# EAGLE design Shematic (EAGLE 9.0.0)
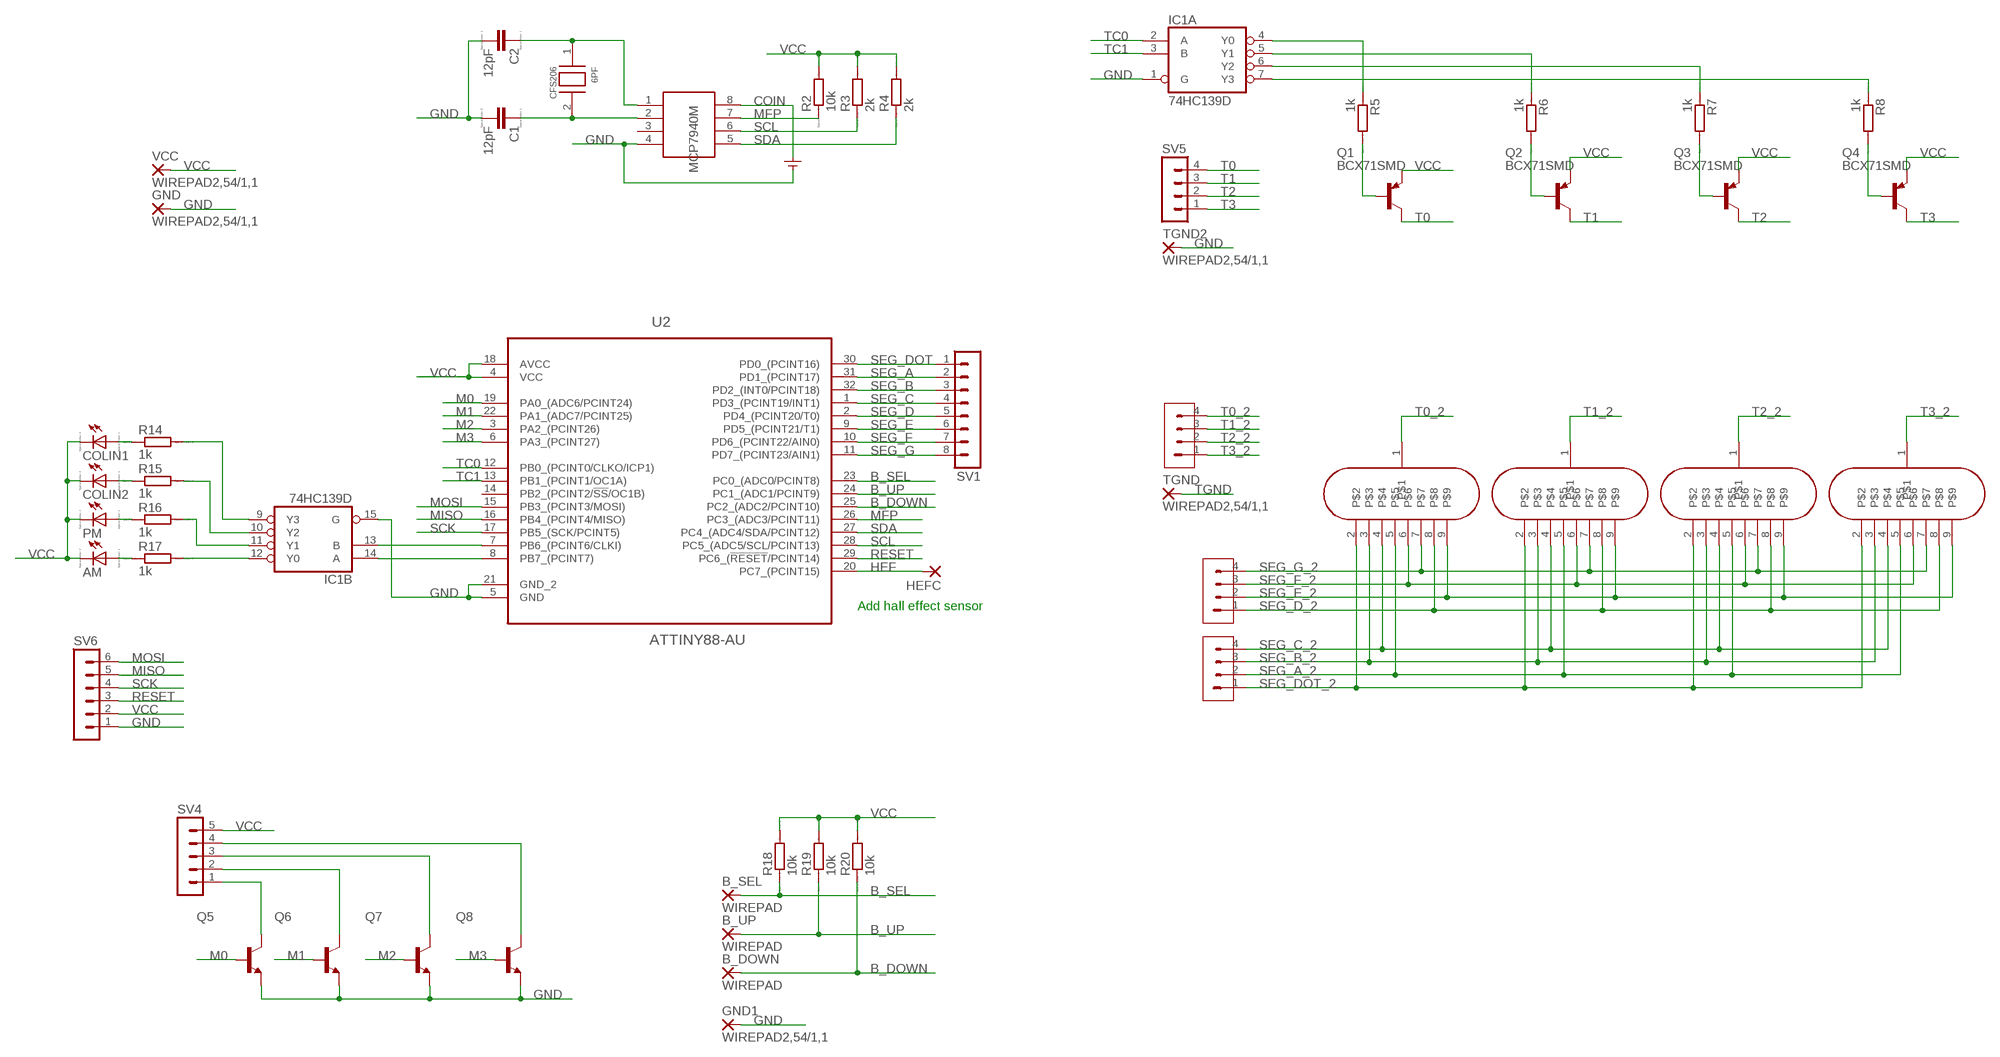
[diagram p0: schematic, sheet 1]

## Parts
6PF  CFS206  [CFS206]
AM  LED_ELD260  [LED_LD260]
B_DOWN  WIREPAD  WIREPAD2,54/1,1  [2,54/1,1]
B_SEL  WIREPAD  WIREPAD2,54/1,1  [2,54/1,1]
B_UP  WIREPAD  WIREPAD2,54/1,1  [2,54/1,1]
C1  12pF  CC1206  [C1206]
C2  12pF  CC1206  [C1206]
COLIN1  LED_ELD260  [LED_LD260]
COLIN2  LED_ELD260  [LED_LD260]
GND  WIREPAD2,54/1,1  [2,54/1,1]
GND1  WIREPAD2,54/1,1  [2,54/1,1]
HEFC  WIREPAD2,54/1,1  [2,54/1,1]
IC1  74HC139D  [SO16]
MCP7940M  SOIC-8  [SOIC-8]
PM  LED_ELD260  [LED_LD260]
Q1  BCX71SMD  [SOT23]
Q2  BCX71SMD  [SOT23]
Q3  BCX71SMD  [SOT23]
Q4  BCX71SMD  [SOT23]
Q5  BCX70SMD  [SOT23]
Q6  BCX70SMD  [SOT23]
Q7  BCX70SMD  [SOT23]
Q8  BCX70SMD  [SOT23]
R2  10k  RR1206  [R1206]
R3  2k  RR1206  [R1206]
R4  2k  RR1206  [R1206]
R5  1k  RR1206  [R1206]
R6  1k  RR1206  [R1206]
R7  1k  RR1206  [R1206]
R8  1k  RR1206  [R1206]
R14  1k  RR1206  [R1206]
R15  1k  RR1206  [R1206]
R16  1k  RR1206  [R1206]
R17  1k  RR1206  [R1206]
R18  10k  RR1206  [R1206]
R19  10k  RR1206  [R1206]
R20  10k  RR1206  [R1206]
SV1  MA08-1  [MA08-1]
SV2  H04  [H04]
SV3  H04  [H04]
SV4  MA05-1  [MA05-1]
SV5  MA04-1  [MA04-1]
SV6  MA06-1  [MA06-1]
SV7  H04  [H04]
TGND  WIREPAD2,54/1,1  [2,54/1,1]
TGND2  WIREPAD2,54/1,1  [2,54/1,1]
TUBE0  IV-9  [IV-9]
TUBE1  IV-9  [IV-9]
TUBE2  IV-9  [IV-9]
TUBE3  IV-9  [IV-9]
U2  ATTINY88-AU  [QFP80P900X900X120-32N]
U$5  COIN  [COIN]
VCC  WIREPAD2,54/1,1  [2,54/1,1]

## Nets
B_DOWN: B_DOWN.1(P) R20.1 U2.25(PC2_(ADC2/PCINT10))
B_SEL: B_SEL.1(P) R18.1 U2.23(PC0_(ADC0/PCINT8))
B_UP: B_UP.1(P) R19.1 U2.24(PC1_(ADC1/PCINT9))
COIN: MCP7940M.8 U$5.V+
GND: C1.2 C2.2 GND1.1(P) GND.1(P) IC1.1(A:G) IC1.15(B:G) MCP7940M.4 Q5.2(E) Q6.2(E) Q7.2(E) Q8.2(E) SV6.1 TGND2.1(P) U2.5(GND) U2.21(GND_2) U$5.V-
HEF: HEFC.1(P) U2.20(PC7_(PCINT15))
M0: Q5.1(B) U2.19(PA0_(ADC6/PCINT24))
M1: Q6.1(B) U2.22(PA1_(ADC7/PCINT25))
M2: Q7.1(B) U2.3(PA2_(PCINT26))
M3: Q8.1(B) U2.6(PA3_(PCINT27))
MFP: MCP7940M.7 R2.1 U2.26(PC3_(ADC3/PCINT11))
MISO: SV6.5 U2.16(PB4_(PCINT4/MISO))
MOSI: SV6.6 U2.15(PB3_(PCINT3/MOSI))
N$1: Q4.1(B) R8.2
N$2: Q3.1(B) R7.2
N$3: Q2.1(B) R6.2
N$4: 6PF.2 C1.1 MCP7940M.2
N$5: Q1.1(B) R5.2
N$6: 6PF.1 C2.1 MCP7940M.1
N$7: COLIN1.A R14.1
N$8: IC1.4(A:Y0) R5.1
N$9: COLIN2.A R15.1
N$10: IC1.5(A:Y1) R6.1
N$11: IC1.6(A:Y2) R7.1
N$12: PM.A R16.1
N$13: IC1.7(A:Y3) R8.1
N$14: AM.A R17.1
N$15: IC1.12(B:Y0) R17.2
N$16: IC1.11(B:Y1) R16.2
N$17: IC1.10(B:Y2) R15.2
N$18: IC1.9(B:Y3) R14.2
N$19: Q5.3(C) SV4.1
N$20: Q6.3(C) SV4.2
N$21: Q7.3(C) SV4.3
N$22: Q8.3(C) SV4.4
N$27: IC1.13(B:B) U2.7(PB6_(PCINT6/CLKI))
N$28: IC1.14(B:A) U2.8(PB7_(PCINT7))
RESET: SV6.3 U2.29(PC6_(!RESET!/PCINT14))
SCK: SV6.4 U2.17(PB5_(SCK/PCINT5))
SCL: MCP7940M.6 R3.1 U2.28(PC5_(ADC5/SCL/PCINT13))
SDA: MCP7940M.5 R4.1 U2.27(PC4_(ADC4/SDA/PCINT12))
SEG_A: SV1.2 U2.31(PD1_(PCINT17))
SEG_A_2: SV7.2 TUBE0.5 TUBE1.5 TUBE2.5 TUBE3.5
SEG_B: SV1.3 U2.32(PD2_(INT0/PCINT18))
SEG_B_2: SV7.3 TUBE0.3 TUBE1.3 TUBE2.3 TUBE3.3
SEG_C: SV1.4 U2.1(PD3_(PCINT19/INT1))
SEG_C_2: SV7.4 TUBE0.4 TUBE1.4 TUBE2.4 TUBE3.4
SEG_D: SV1.5 U2.2(PD4_(PCINT20/T0))
SEG_D_2: SV2.1 TUBE0.8 TUBE1.8 TUBE2.8 TUBE3.8
SEG_DOT: SV1.1 U2.30(PD0_(PCINT16))
SEG_DOT_2: SV7.1 TUBE0.2 TUBE1.2 TUBE2.2 TUBE3.2
SEG_E: SV1.6 U2.9(PD5_(PCINT21/T1))
SEG_E_2: SV2.2 TUBE0.9 TUBE1.9 TUBE2.9 TUBE3.9
SEG_F: SV1.7 U2.10(PD6_(PCINT22/AIN0))
SEG_F_2: SV2.3 TUBE0.6 TUBE1.6 TUBE2.6 TUBE3.6
SEG_G: SV1.8 U2.11(PD7_(PCINT23/AIN1))
SEG_G_2: SV2.4 TUBE0.7 TUBE1.7 TUBE2.7 TUBE3.7
T0: Q1.3(C) SV5.4
T0_2: SV3.4 TUBE0.1
T1: Q2.3(C) SV5.3
T1_2: SV3.3 TUBE1.1
T2: Q3.3(C) SV5.2
T2_2: SV3.2 TUBE2.1
T3: Q4.3(C) SV5.1
T3_2: SV3.1 TUBE3.1
TC0: IC1.2(A:A) U2.12(PB0_(PCINT0/CLKO/ICP1))
TC1: IC1.3(A:B) U2.13(PB1_(PCINT1/OC1A))
TGND: TGND.1(P)
VCC: AM.K(C) COLIN1.K(C) COLIN2.K(C) PM.K(C) Q1.2(E) Q2.2(E) Q3.2(E) Q4.2(E) R2.2 R3.2 R4.2 R18.2 R19.2 R20.2 SV4.5 SV6.2 U2.4(VCC) U2.18(AVCC) VCC.1(P)
Unconnected: MCP7940M.3 U2.14(PB2_(PCINT2/!SS!/OC1B))

## Notes on the sheet
- Add hall effect sensor

## Power pins joined to a net without a drawn wire
GND: IC1.8(P:GND)
VCC: IC1.16(P:VCC)

## Library data of the parts
6PF = Library:CFS206
AM COLIN1 COLIN2 PM = eagle-ltspice:LED_E: LED Source: http://www.osram.convergy.de Source: www.luxeon.com Source: www.kingbright.com; SPICEMODEL: NONE; SPICEPREFIX: D; SPICETYPE: diode
B_DOWN B_SEL B_UP GND GND1 HEFC TGND TGND2 VCC = wirepad:WIREPAD: Wire PAD connect wire on PCB
C1 C2 = eagle-ltspice:C: CAPACITOR, European symbol; SPICEMODEL: NONE; SPICEPREFIX: C
IC1 = 74xx-eu:74*139: Dual 2-line to 4-line DECODER/DEMULTIPLEXER
MCP7940M = smd-footprints:SOIC-8
Q1-Q4 = transistor-pnp:BCX71SMD: PNP Transistor
Q5-Q8 = transistor-npn:BCX70*: NPN Transistor
R2-R8 R14-R20 = eagle-ltspice:R: RESISTOR, European symbol; SPICEMODEL: NONE; SPICEPREFIX: R
SV1 = con-lstb:MA08-1: PIN HEADER; OC_FARNELL: unknown; OC_NEWARK: unknown
SV2 SV3 SV7 = Library:H04
SV4 = con-lstb:MA05-1: PIN HEADER; OC_FARNELL: unknown; OC_NEWARK: unknown
SV5 = con-lstb:MA04-1: PIN HEADER; OC_FARNELL: unknown; OC_NEWARK: unknown
SV6 = con-lstb:MA06-1: PIN HEADER; OC_FARNELL: unknown; OC_NEWARK: unknown
TUBE0 TUBE1-TUBE3 = Library:IV-9
U2 = Library:ATTINY88-AU: IC, 8BIT MCU, AVR Tiny, 12MHZ, TQFP-32; MPN: ATTINY88-AU; OC_FARNELL: 1704570; OC_NEWARK: 68T3851; PACKAGE: TQFP-32; SUPPLIER: ATMEL
U$5 = Library:COIN

## Board
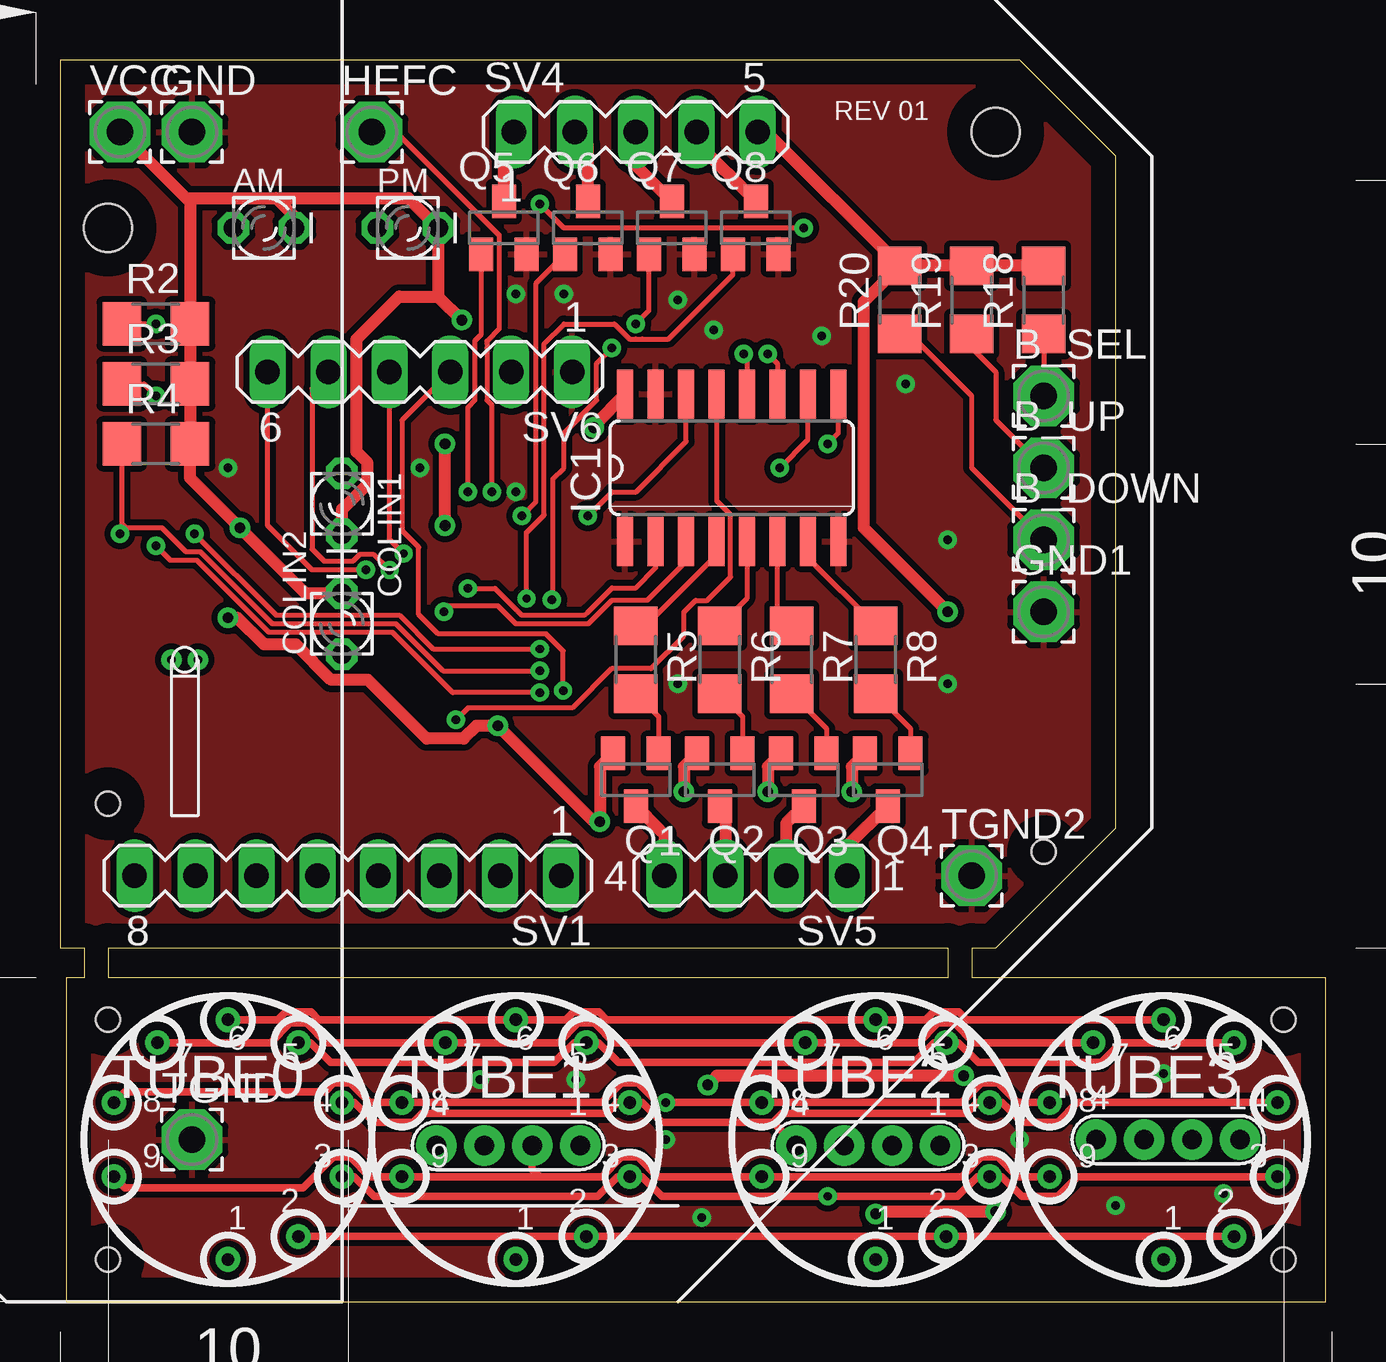
[diagram p1: board, top side]
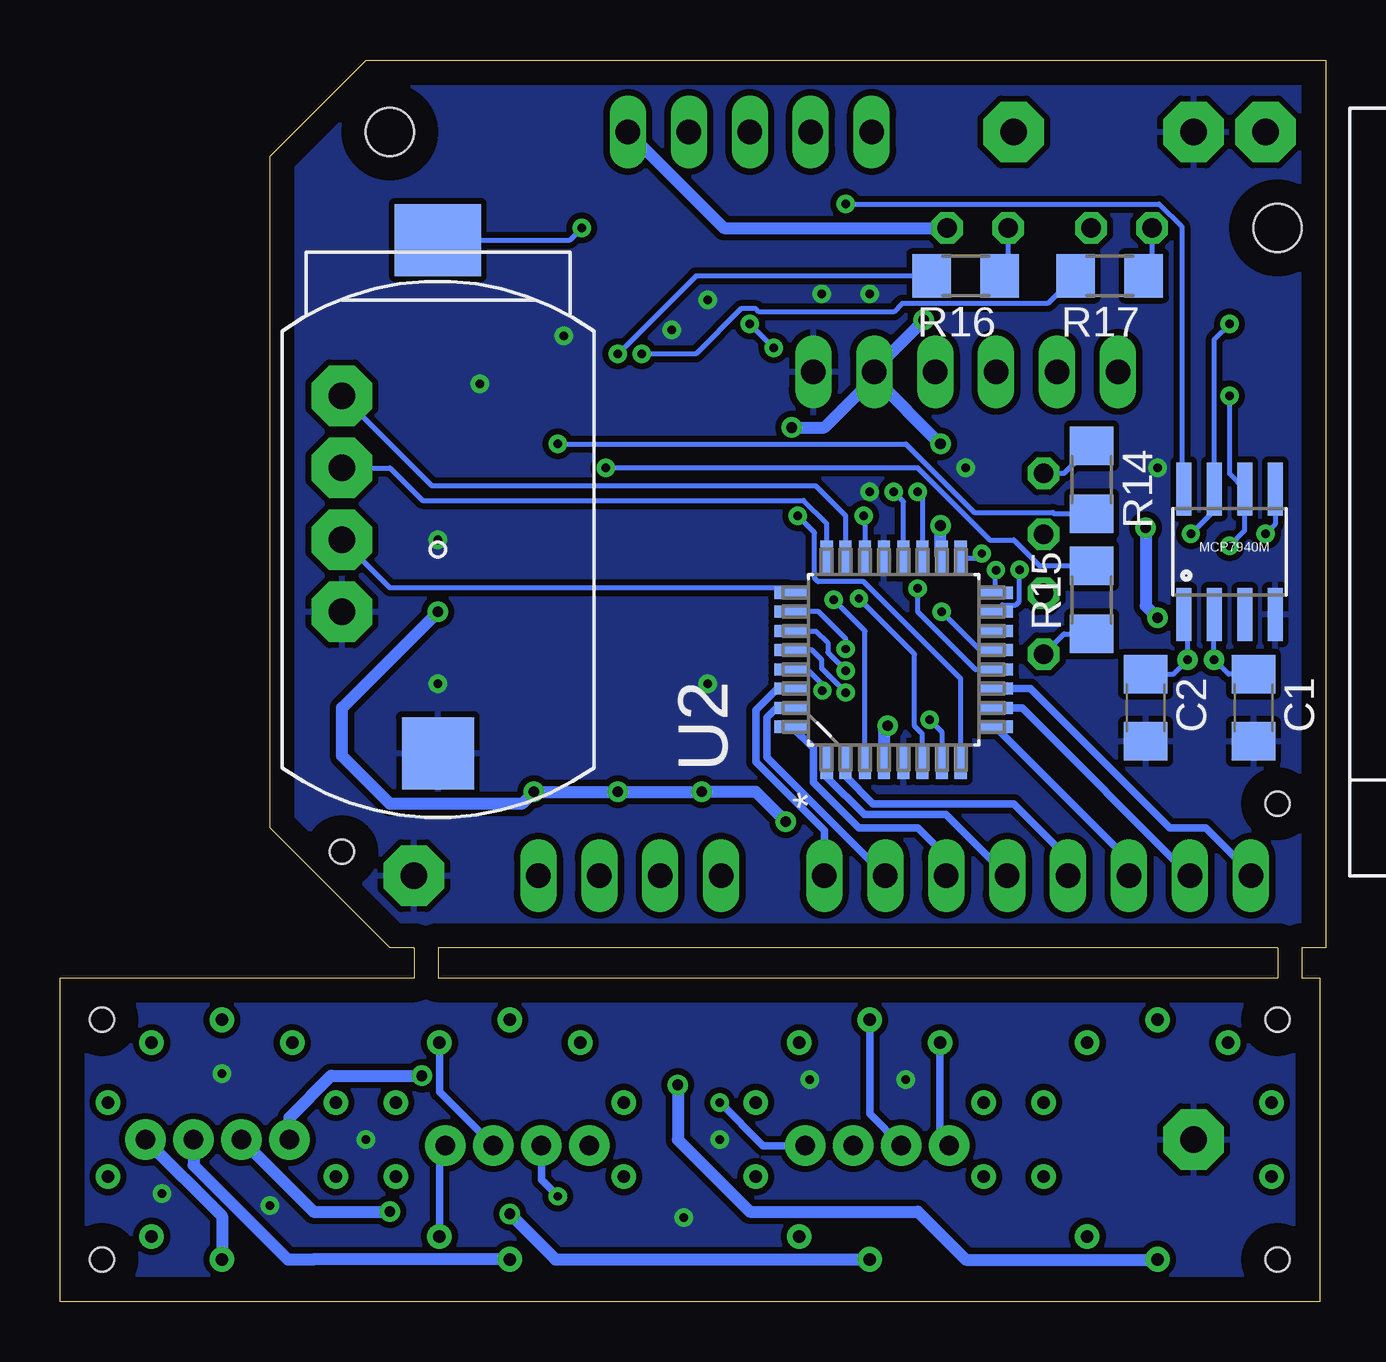
[diagram p2: board, bottom side, seen from below]

Size 52.75 x 51.75 mm. Coordinates in mm from the lower left corner, seen from the top.
Outline: 0.25,0 52.75,0 52.75,13.5 38,13.5 38,14.75 39,14.75 44,19.75 44,47.75 40,51.75 0,51.75 0,14.75 1,14.75 1,13.5 0.25,13.5 0.25,0
Outline: 37,13.5 2,13.5 2,14.75 37,14.75 37,13.5
Copper layers (1*16): Top 0.035mm / dielectric 1.5mm / Bottom 0.035mm
Design rules "default": minimum track width 6mil, minimum drill 0.35mm, track to track 6mil, track to pad 6mil, pad to pad 6mil, via to via 6mil, smd to smd 6mil, copper to edge 40mil, drill to drill 6mil, minimum pad ring 10mil, minimum via ring 8mil, stop-mask expansion 4mil, vias tented up to drill 0mil, thermal gap 10mil
Holes 3 mm at -42,19.75 -42,45.75
Holes 1 mm at 2,20.75 41,18.75 2,11.75 2,1.75 51,1.75 51,11.75
Holes 2 mm at 2,44.75 39,48.75

### Footprints (pad centres in the part's own frame; a part is rotated, then mirrored left to right if it is on the bottom)
CFS206 = drill 0.35: 1 0,0; 2 1.1,0
LED_LD260 = drill 0.813 octagon: A -1.27,0; K 1.27,0
2,54/1,1 = drill 1.118 pad 2.54 octagon: 1 0,0
C1206 = smd 1.6 x 1.8: 1 -1.4,0; 2 1.4,0
SO16 = smd 0.66 x 2.032: 1 -4.445,-3.073; 2 -3.175,-3.073; 3 -1.905,-3.073; 4 -0.635,-3.073; 5 0.635,-3.073; 6 1.905,-3.073; 7 3.175,-3.073; 8 4.445,-3.073; 9 4.445,3.073; 10 3.175,3.073; 11 1.905,3.073; 12 0.635,3.073; 13 -0.635,3.073; 14 -1.905,3.073; 15 -3.175,3.073; 16 -4.445,3.073
SOIC-8 = smd 0.61 x 2.21: 1 -1.905,-2.616; 2 -0.635,-2.616; 3 0.635,-2.616; 4 1.905,-2.616; 5 1.905,2.616; 6 0.635,2.616; 7 -0.635,2.616; 8 -1.905,2.616
SOT23 = smd 1 x 1.4: 1 -0.95,-1.1; 2 0.95,-1.1; 3 0,1.1
R1206 = smd 1.6 x 1.803: 1 -1.422,0; 2 1.422,0
MA08-1 = drill 1.016 long: 1 -8.89,0; 2 -6.35,0; 3 -3.81,0; 4 -1.27,0; 5 1.27,0; 6 3.81,0; 7 6.35,0; 8 8.89,0
H04 = drill 0.8 pad 1.676: 1 2.936,0; 2 0.936,0; 3 -1.064,0; 4 -3.064,0
MA05-1 = drill 1.016 long: 1 -5.08,0; 2 -2.54,0; 3 0,0; 4 2.54,0; 5 5.08,0
MA04-1 = drill 1.016 long: 1 -3.81,0; 2 -1.27,0; 3 1.27,0; 4 3.81,0
MA06-1 = drill 1.016 long: 1 -6.35,0; 2 -3.81,0; 3 -1.27,0; 4 1.27,0; 5 3.81,0; 6 6.35,0
IV-9 = drill 0.525: 1 0,-4.994; 2 2.936,-4.041; 3 4.75,-1.543; 4 4.75,1.543; 5 2.936,4.041; 6 0,4.994; 7 -2.936,4.041; 8 -4.75,1.543; 9 -4.75,-1.543
QFP80P900X900X120-32N = smd 1.473 x 0.508: 1 -4.242,2.794; 2 -4.242,2.007; 3 -4.242,1.194; 4 -4.242,0.406; 5 -4.242,-0.406; 6 -4.242,-1.194; 7 -4.242,-2.007; 8 -4.242,-2.794; 17 4.242,-2.794; 18 4.242,-2.007; 19 4.242,-1.194; 20 4.242,-0.406; 21 4.242,0.406; 22 4.242,1.194; 23 4.242,2.007; 24 4.242,2.794 | smd 0.508 x 1.473: 9 -2.794,-4.242; 10 -2.007,-4.242; 11 -1.194,-4.242; 12 -0.406,-4.242; 13 0.406,-4.242; 14 1.194,-4.242; 15 2.007,-4.242; 16 2.794,-4.242; 25 2.794,4.242; 26 2.007,4.242; 27 1.194,4.242; 28 0.406,4.242; 29 -0.406,4.242; 30 -1.194,4.242; 31 -2.007,4.242; 32 -2.794,4.242
COIN = smd 3.6 x 3: V+ 0,-1.5 | smd 3 x 3: V- 0,19.9

### Placement (x,y rotation side)
6PF  5.75,26.75 180 top
AM  8.5,44.75 0 top
B_DOWN  41,31.75 0 top
B_SEL  41,37.75 0 top
B_UP  41,34.75 0 top
C1  3,24.75 270 bottom
C2  7.5,24.75 270 bottom
COLIN1  11.75,33.25 270 top
COLIN2  11.75,28.25 90 top
GND  5.5,48.75 0 top
GND1  41,28.75 0 top
HEFC  13,48.75 0 top
IC1  28,34.75 0 top
MCP7940M  4,31.25 0 bottom
PM  14.5,44.75 0 top
Q1  24,21.75 180 top
Q2  27.5,21.75 180 top
Q3  31,21.75 180 top
Q4  34.5,21.75 180 top
Q5  18.5,44.75 0 top
Q6  22,44.75 0 top
Q7  25.5,44.75 0 top
Q8  29,44.75 0 top
R2  4,40.75 0 top
R3  4,38.25 0 top
R4  4,35.75 0 top
R5  24,26.75 270 top
R6  27.5,26.75 270 top
R7  30.5,26.75 270 top
R8  34,26.75 270 top
R14  9.75,34.25 270 bottom
R15  9.75,29.25 90 bottom
R16  15,42.75 180 bottom
R17  9,42.75 180 bottom
R18  41,41.75 90 top
R19  38,41.75 90 top
R20  35,41.75 90 top
SV1  12,17.75 180 top
SV2  18.75,6.5 0 top
SV3  46.25,6.75 0 top
SV4  24,48.75 0 top
SV5  29,17.75 180 top
SV6  15,38.75 180 top
SV7  33.75,6.5 0 top
TGND  5.5,6.75 0 top
TGND2  38,17.75 0 top
TUBE0  7,6.75 0 top
TUBE1  19,6.75 0 top
TUBE2  34,6.75 0 top
TUBE3  46,6.75 0 top
U2  18,26.75 90 bottom
U$5  37,42.75 180 bottom
VCC  2.5,48.75 0 top

### Tracks (layer width: path | path; a pad name or v marks a point on that pad's centre or on a via)
B_DOWN
  Top 0.203: R20.1 35.42,40.33 38,37.75 38,34.75 B_DOWN.1
  Bottom 0.203: U2.25 22.45,29.75 39,29.75 B_DOWN.1
B_SEL
  Top 0.203: R18.1 B_SEL.1
  Bottom 0.203: U2.23 20,32.75 21.25,34 37.25,34 B_SEL.1
B_UP
  Top 0.203: R19.1 38,39.75 39,38.75 39,36.75 B_UP.1
  Bottom 0.203: B_UP.1 39,34.75 37.64,33.39 21.75,33.39 20.79,32.44 U2.24
COIN  (via drill 0.35)
  Top 0.203: v31,44.75 21,44.75 v20,45.75
  Bottom 0.203: U$5.V+ 31.5,44.25 v31,44.75 | v20,45.75 6.94,45.75 6,44.81 6,33.96 MCP7940M.8
GND  (via drill 0.35)
  other vias: 7,34.75 37,31.75 19,33.75 15,34.75 19,42 21,42 25.75,41.75 27.25,40.5 37,25.75 25.75,25.75 35.25,38.25 31.75,40.25
  pour Top (isolate 0.254, rank 2): 1,53.75 2,53.75 2,51.75 40,51.75 44,47.75 44,19.75 39,14.75 0,14.75 0,51.75 1,51.75
  pour Bottom (isolate 0.254, rank 2): 3,53.75 4,53.75 4,51.75 40,51.75 44,47.75 44,19.75 39,14.75 0,14.75 0,51.75 3,51.75
HEF  (via drill 0.35)
  Top 0.203: v18,33.75 18,37.36 17.79,37.57 17.79,39.75 17.79,39.93 17.79,40.04 18.3,40.55 18.3,44.45 14.01,48.75 HEFC.1
  Bottom 0.203: U2.20 17.59,33.34 v18,33.75
M0  (via drill 0.35)
  Top 0.203: v17,33.75 17,37.28 17.29,37.57 17.29,40.04 17.55,40.3 Q5.1
  Bottom 0.203: v17,33.75 16.81,33.56 U2.19
M1  (via drill 0.35)
  Top 0.203: Q6.1 19.83,42.43 19.83,37.75 19.83,37.57 19.83,33.33 v19.25,32.75
  Bottom 0.203: v19.25,32.75 19.19,32.69 U2.22
M2  (via drill 0.35)
  Top 0.203: v20.5,29.25 20.54,29.29 20.54,34.29 21,34.75 21,36.2 22.37,37.57 22.37,39.12 v23,39.75 | v24,40.75 24.55,41.3 Q7.1
  Bottom 0.203: U2.3 19.19,27.94 v20.5,29.25 | v23,39.75 v24,40.75
M3  (via drill 0.35)
  Top 0.203: v19.45,29.3 19.45,32.05 20.18,32.79 20.18,39.93 21,40.75 23.11,40.75 23.74,40.12 24,40.12 24.26,40.12 25.37,40.12 28.05,42.8 Q8.1
  Bottom 0.203: U2.6 16.81,23.66 17.13,23.99 17.13,26.99 v19.45,29.3
MFP  (via drill 0.35)
  Top 0.203: v4,40.75 R2.1 | v20,27.2 15.56,27.2 14.15,28.61 9.01,28.61 v5.61,32
  Bottom 0.203: v4,40.75 4.63,40.12 MCP7940M.7 4.63,32.98 v5.61,32 | U2.26 21.14,28.76 20,27.62 v20,27.2
MISO  (via drill 0.35)
  Top 0.203: v13.73,30.48 13.08,31.13 12.49,31.13 12.21,30.86 11,30.86 10.5,31.36 10.5,38.06 SV6.5
  Bottom 0.203: U2.16 13.76,30.46 v13.73,30.48
MOSI  (via drill 0.35)
  Top 0.203: v12.75,30.5 10.5,30.5 8.65,32.35 SV6.6
  Bottom 0.203: U2.15 13.48,29.04 12.92,29.04 12.77,29.19 12.77,30.48 v12.75,30.5
N$1
  Top 0.203: R8.2 35.45,23.88 Q4.1
N$2
  Top 0.203: R7.2 31.95,23.88 Q3.1
N$3
  Top 0.203: R6.2 28.45,24.38 Q2.1
N$4
  Bottom 0.203: MCP7940M.2 4.65,28.62 6PF.2 4.05,26.15 C1.1
N$5
  Top 0.203: R5.2 24.95,24.38 Q1.1
N$6
  Bottom 0.203: C2.1 6.35,26.15 6PF.1 5.75,28.48 MCP7940M.1
N$7
  Bottom 0.203: R14.1 10.9,34.52 COLIN1.A
N$8
  Top 0.203: IC1.4 27.36,31.12 24.42,28.17 R5.1
N$9
  Bottom 0.203: COLIN2.A 10.9,27.83 R15.1
N$10
  Top 0.203: IC1.5 28.64,29.31 R6.1
N$11
  Top 0.203: R7.1 29.91,28.77 IC1.6
N$12
  Bottom 0.203: PM.A 13.23,43.1 R16.1
N$13
  Top 0.203: R8.1 31.18,31 IC1.7
N$14
  Bottom 0.203: AM.A 7.23,43.1 R17.1
N$15  (via drill 0.35)
  Top 0.203: v28.5,39.5 28.64,39.37 IC1.12
  Bottom 0.203: R17.2 11.58,41.59 17.66,41.59 18,41.25 23.61,41.25 23.74,41.38 24.37,41.38 26.25,39.5 v28.5,39.5
N$16  (via drill 0.35)
  Top 0.203: v29.5,39.5 29.91,39.09 IC1.11
  Bottom 0.203: v29.5,39.5 26.25,42.75 R16.2
N$17  (via drill 0.35)
  Top 0.203: IC1.10 31.18,35.92 v30,34.75
  Bottom 0.203: v30,34.75 17,34.75 14,31.75 13,31.75 11.92,30.67 R15.2
N$18  (via drill 0.35)
  Top 0.203: 32.25,37.63 IC1.9 32.45,36.2 v32,35.75
  Bottom 0.203: R14.2 11.3,32.83 11.37,32.89 14.64,32.89 17.5,35.75 v32,35.75
N$19
  Top 0.508: Q5.3 18.5,48.33 SV4.1
N$20
  Top 0.508: Q6.3 22,48.21 SV4.2
N$21
  Top 0.508: Q7.3 24,47.35 SV4.3
N$22
  Top 0.508: Q8.3 26.54,48.31 SV4.4
N$27  (via drill 0.35)
  Top 0.203: IC1.13 27.36,33.38 27.95,32.8 27.95,30.2 26.98,29.23 26.49,29.23 26,28.73 26,27.75 24.63,26.38 22.99,26.38 21.36,24.75 17,24.75 v16.5,24.25
  Bottom 0.203: v16.5,24.25 15.99,23.74 U2.7
N$28  (via drill 0.35)
  Top 0.203: v22,32.75 23,33.75 24,33.75 26.09,35.84 IC1.14
  Bottom 0.203: U2.8 15.21,25.96 18,28.75 19.25,30 21.15,30 21.3,30.15 21.3,32.05 v22,32.75
RESET  (via drill 0.35)
  Top 0.203: v20.98,25.46 20.98,27.12 20.26,27.83 15.76,27.83 14.95,28.64 14.95,31.44 14.25,32.14 14.25,36.73 SV6.3
  Bottom 0.203: U2.29 21.59,26.34 20.98,25.73 v20.98,25.46
SCK  (via drill 0.35)
  Top 0.203: v14.32,31.18 13.73,31.77 SV6.4
  Bottom 0.203: U2.17 14.51,30.99 v14.32,31.18
SCL  (via drill 0.35)
  Top 0.203: v20,25.38 16.37,25.38 13.86,27.89 8.71,27.89 5.71,30.89 4.61,30.89 v4,31.5 | R3.1 3.5,38.25 v4,37.75
  Bottom 0.203: v4,31.5 3.37,32.13 MCP7940M.6 4,34.5 v4,37.75 | U2.28 21.41,27.16 21,26.75 21,26.38 v20,25.38
SDA  (via drill 0.35)
  Top 0.203: v20,26.29 15.96,26.29 14,28.25 8.86,28.25 5.86,31.25 5.25,31.25 4.25,32.25 2.75,32.25 | v2.5,32 2.75,32.25 | R4.1 2.58,32.42 2.75,32.25
  Bottom 0.203: U2.27 21.23,27.94 20.75,27.46 20.75,27.06 20.26,26.57 20.07,26.57 20,26.5 v20,26.29 | v2.5,32 2.1,32.41 MCP7940M.5
SEG_A
  Bottom 0.305: SV1.2 23.18,22.57 23.28,22.68 23.28,24.34 22.88,24.74 U2.31
SEG_A_2
  Top 0.305: TUBE0.5 10.45,10.79 11.27,9.97 20.6,9.97 21.42,10.79 TUBE1.5 22.45,10.79 23.27,9.97 35.6,9.97 36.42,10.79 TUBE2.5 37.45,10.79 38.27,9.97 43.4,9.97 44.23,10.79 TUBE3.5
  Bottom 0.305: SV7.2 36.94,8.75 TUBE2.5
SEG_B
  Bottom 0.305: U2.32 21.35,23.07 21.35,21.64 19.46,19.75 17,19.75 15.81,18.56 SV1.3
SEG_B_2  (via drill 0.35)
  Top 0.305: TUBE0.3 12.27,5.21 13.09,4.38 22.41,4.38 23.23,5.21 TUBE1.3 24.27,5.21 25.09,4.38 v32,4.38 37.41,4.38 38.23,5.21 TUBE2.3 39.27,5.21 40.09,4.38 41.59,4.38 42.41,5.21 TUBE3.3
  Bottom 0.305: SV7.3 32.69,5.07 v32,4.38
SEG_C
  Bottom 0.305: SV1.4 15.81,20.29 19.21,20.29 20.79,21.87 U2.1
SEG_C_2
  Top 0.305: TUBE0.4 12.27,8.29 13.09,7.47 14.72,7.47 15.09,7.84 22.78,7.84 23.23,8.29 TUBE1.4 24.27,8.29 25.09,7.47 29.72,7.47 | TUBE3.4 42.41,8.29 41.59,7.47 40.09,7.47 39.27,8.29 TUBE2.4 38.23,8.29 37.78,7.84 30.09,7.84 29.72,7.47 | SV7.4 29.72,7.46 29.72,7.47
SEG_D
  Bottom 0.305: SV1.5 10.73,18.48 13,20.75 18.86,20.75 20.01,21.9 U2.2
SEG_D_2  (via drill 0.35)
  Top 0.305: TUBE3.8 39.91,8.29 39.09,9.12 38.41,9.12 37.59,8.29 TUBE2.8 v25.25,8.29 24.91,8.29 24.09,9.12 23.41,9.12 22.59,8.29 TUBE1.8 12.91,8.29 12.09,9.12 11.41,9.12 11.04,8.75 2.71,8.75 TUBE0.8
  Bottom 0.305: SV2.1 23.46,6.5 v25.25,8.29
SEG_DOT
  Bottom 0.305: SV1.1 20.89,19.64 23.74,22.49 23.74,24.67 22.85,25.56 U2.30
SEG_DOT_2
  Top 0.305: TUBE0.2 TUBE1.2 TUBE2.2 TUBE3.2
  Bottom 0.305: SV7.1 36.94,6.25 TUBE2.2
SEG_E
  Bottom 0.305: U2.9 8.19,18.39 SV1.6
SEG_E_2
  Top 0.305: 20,5.21 TUBE1.9 12.91,5.21 12.09,6.03 11.41,6.03 10.13,4.75 2.71,4.75 TUBE0.9 | 20,5.21 22.59,5.21 23.41,6.03 24.09,6.03 24.91,5.21 TUBE2.9 37.59,5.21 38.41,6.03 39.09,6.03 39.91,5.21 TUBE3.9 | SV2.2 19.69,5.52 20,5.21
SEG_F
  Bottom 0.305: U2.10 12.64,24.74 SV1.7
SEG_F_2
  Top 0.305: TUBE0.6 9.08,11.74 9.41,12.07 10.46,12.07 10.79,11.74 TUBE1.6 21.08,11.74 21.41,12.07 22.46,12.07 22.79,11.74 TUBE2.6 36.08,11.74 36.41,12.07 37.47,12.07 37.79,11.74 TUBE3.6
  Bottom 0.305: SV2.3 19,7.81 TUBE1.6
SEG_G
  Bottom 0.305: U2.11 12.31,25.56 6.5,19.75 5,19.75 3.11,17.86 SV1.8
SEG_G_2
  Top 0.305: TUBE0.7 8.77,10.79 9.6,11.61 10.28,11.61 11.1,10.79 TUBE1.7 20.77,10.79 21.6,11.61 22.28,11.61 23.1,10.79 TUBE2.7 35.77,10.79 36.6,11.61 37.28,11.61 38.1,10.79 TUBE3.7
  Bottom 0.305: SV2.4 16.06,6.88 TUBE1.7
T0
  Top 0.508: Q1.3 24.95,19.7 | 24.95,19.7 25.19,19.46 SV5.4 | 24.95,19.7
T0_2  (via drill 0.45)
  Top 0.508: v37.67,9.41 27.38,9.41 v27,9.03
  Bottom 0.508: TUBE0.1 15,1.75 17,3.75 24,3.75 27,6.75 v27,9.03 | v37.67,9.41 41.44,9.41 43.19,7.66 SV3.4
T1
  Top 0.508: Q2.3 27.73,20.42 SV5.3
T1_2  (via drill 0.45)
  Top 0.508: v39,3.75 34.1,3.75 v34,3.65
  Bottom 0.508: SV3.3 42.19,3.75 v39,3.75 | v34,3.65 32.1,1.76 TUBE1.1
T2
  Top 0.508: Q3.3 30.27,19.92 SV5.2
T2_2
  Bottom 0.508: TUBE2.1 42.19,1.76 43.26,1.76 47.19,5.69 SV3.2
T3
  Top 0.508: Q4.3 32.81,18.96 SV5.1
T3_2
  Bottom 0.508: SV3.1 46,3.56 TUBE3.1
TC0  (via drill 0.35)
  Top 0.203: 25,30.75 24.82,30.92 IC1.2 24.82,30.58 24,29.75 23,29.75 22,28.75 21.87,28.62 19.24,28.62 19.18,28.67 19.05,28.8 18.13,29.73 v17,29.73
  Bottom 0.203: U2.12 14.59,26.34 17,28.75 v17,29.73
TC1  (via drill 0.35)
  Top 0.203: IC1.3 26.09,30.84 24.48,29.23 22.99,29.23 22.02,28.25 19,28.25 18.25,29 16.24,29 16,28.76 v16,28.75
  Bottom 0.203: U2.13 14.41,27.16 v16,28.75
TGND  (via drill 0.35)
  other vias: 17.5,9.25 21.5,9.25 26.75,3.5 46,9.5 48.5,4.5 25.25,6.75 44,4 40,6.75
  pour Top (isolate 0.254): 0.25,13.5 52.75,13.5 52.75,0 0.25,0 0.25,11.75 -2,11.75 -2,12.75 0.25,12.75
  pour Bottom (isolate 0.254): 0.25,13.5 52.75,13.5 52.75,0 0.25,0 0.25,9.75 -2,9.75 -2,10.75 0.25,10.75
VCC  (via drill 0.45)
  Top 0.508: VCC.1 5.25,46 | 5.25,46 5.42,45.83 R2.2 R3.2 R4.2 5.42,34.33 v7.5,32.25 10.23,29.52 COLIN2.K | 5.25,46 9,46 | 9,46 14.52,46 PM.K 15.77,41.89 | AM.K 9.77,45.23 9,46 | R18.2 R19.2 R20.2 | R20.2 29.42,48.75 SV4.5 | 15.77,41.89 v16.75,40.91 | COLIN1.K 11.75,33.01 12.82,34.08 12.82,34.96 12.36,35.42 12.36,40.11 14.14,41.89 15.77,41.89 | Q2.2 26,22.3 v26,21.25 | Q3.2 29.5,22.3 v29.5,21.25 | Q4.2 33,22.3 v33,21.25 | Q1.2 22.5,22.3 v22.5,20 22.25,20 v18.25,24 17.36,24 16.82,23.46 15.29,23.46 12.84,25.91 11.31,25.91 9.84,27.39 8.5,27.39 7.39,28.5 v7,28.5 | v16.05,32.34 v16.05,35.75 | IC1.16 22.25,36.52 v22.25,36.43 | v37,28.75 33.5,32.25 33.5,41.67 R20.2
  Bottom 0.508: SV4.5 25.08,44.75 PM.K | 18.81,38.86 SV6.2 | v16.75,40.91 18.81,38.85 SV6.2 | v22.5,20 23.75,21.25 v26,21.25 v29.5,21.25 v33,21.25 33.5,20.75 39,20.75 41,22.75 41,24.75 v37,28.75 | v18.25,24 18.41,23.84 U2.4 | U2.18 16.05,31.05 v16.05,32.34 | v16.05,35.75 18.81,38.51 | 18.81,38.51 SV6.2 | v22.25,36.43 20.89,36.43 18.81,38.51 | v7.5,32.25 7.5,29 v7,28.5

### Text on the board
tPlace: REV 01 | Bottom
bPlace: Top